# Altium project Servo Bus Controller.PrjPcb
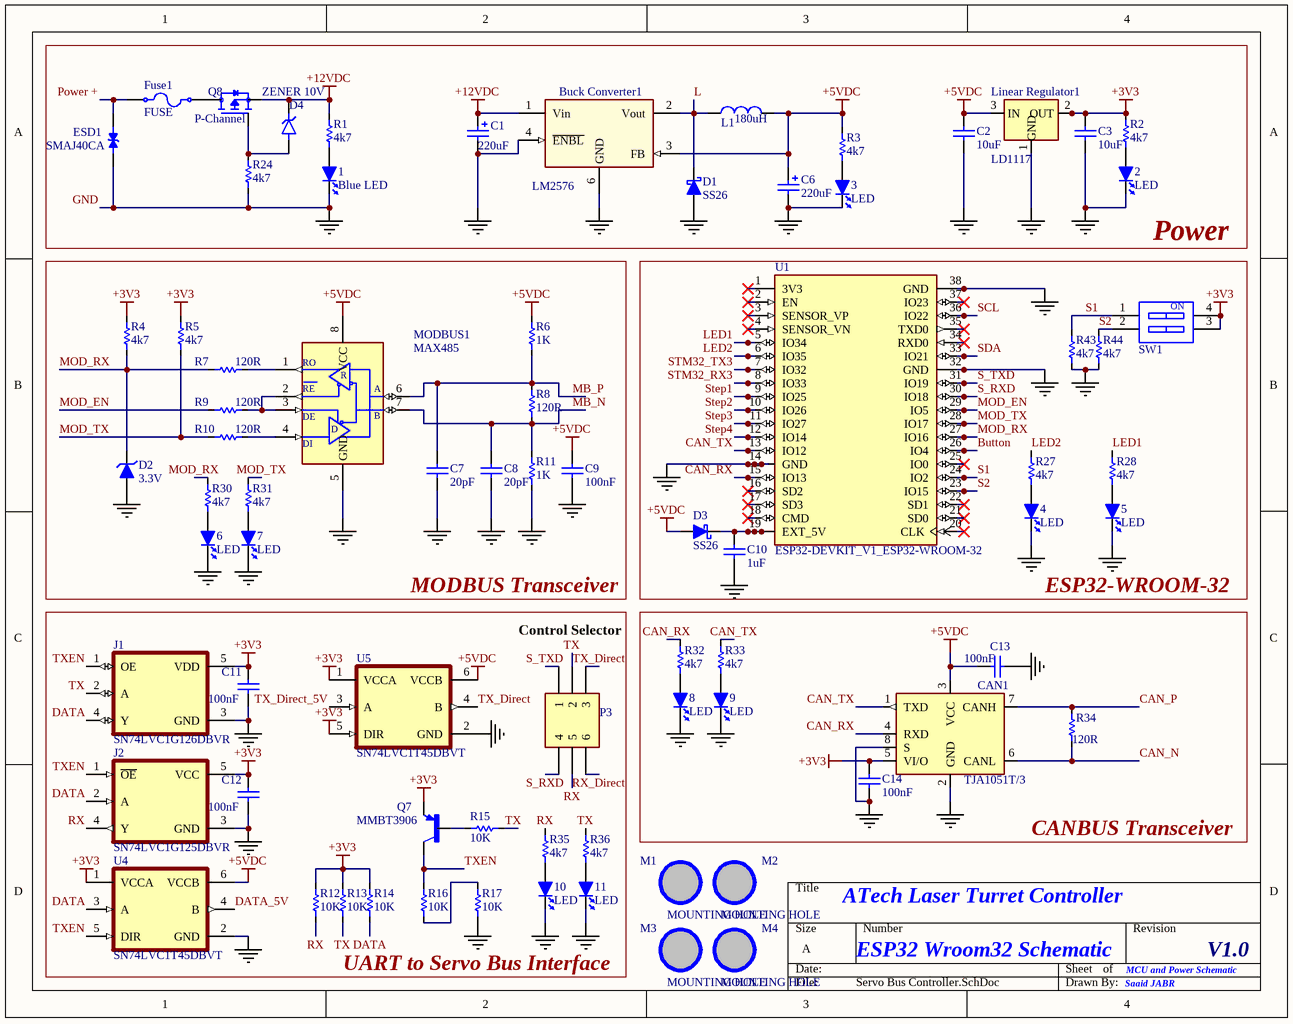
[diagram p0: Servo Bus Controller.SchDoc]
3 sheets, 209 parts. Net scope: global (net labels, ports and power ports of the same name join across sheets).
Board file: LaserTurretController.PcbDoc
Sheets:
  Servo Bus Controller.SchDoc
  STM32 Control.SchDoc
  Actuator Control.SchDoc

## Sheet Servo Bus Controller.SchDoc
size A; SheetNumber: 1; SheetTotal: 3

### Parts
1  Blue LED  [LED1206]
2  LED  [LED1206]
3  LED  [LED1206]
4  LED  [LED1206]
5  LED  [LED1206]
6  LED  [LED1206]
7  LED  [LED1206]
8  LED  [LED1206]
9  LED  [LED1206]
10  LED  [LED1206]
11  LED  [LED1206]
Buck_Converter1  LM2576  [TO-263BA]
C1  220uF  [CAP AL-EL H12MM D8MM P3.5MM]
C2  10uF  [CC3216-1206L]
C3  10uF  [CC3216-1206L]
C6  220uF  [CAP AL-EL H12MM D8MM P3.5MM]
C7  20pF  [CC3216-1206L]
C8  20pF  [CC3216-1206L]
C9  100nF  [CC3216-1206L]
C10  1uF  [CC3216-1206L]
C11  100nF  [CC3216-1206L]
C12  100nF  [CC3216-1206L]
C13  100nF  [CC3216-1206L]
C14  100nF  [CC3216-1206L]
CAN1  TJA1051T/3  [SOT96-1]
D1  SS26  [SMB]
D2  3.3V  [SOD123]
D3  SS26  [SMB]
D4  ZENER 10V  [DIOAD1036W73L450D282]
ESD1  SMAJ40CA  [DIOM4325X250N]
Fuse1  FUSE  [FUSE 5x20]
J1  SN74LVC1G126DBVR  [SOT95P280X145-5N]
J2  SN74LVC1G125DBVR  [SOT95P280X145-5N]
L1  180uH  [FPI1005]
Linear_Regulator1  LD1117  [SOT230P700X180-4N]
M1  MOUNTING HOLE  [MOUNTING HOLE ROUND NONPLATED 3MM PLASTIC]  (no BOM)
M2  MOUNTING HOLE  [MOUNTING HOLE ROUND NONPLATED 3MM PLASTIC]  (no BOM)
M3  MOUNTING HOLE  [MOUNTING HOLE ROUND NONPLATED 3MM PLASTIC]  (no BOM)
M4  MOUNTING HOLE  [MOUNTING HOLE ROUND NONPLATED 3MM PLASTIC]  (no BOM)
MODBUS1  MAX485  [SOIC127P600X175-8N]
P3  CONNECTOR, 1x3, 3P  [HDR_MALE_2X3_6P_2.54MM_180]  (value not drawn)
Q7  MMBT3906  [SOT95P260X140-3N]
Q8  P-Channel  [TO254P1052X465X1989-3]
R1  4k7  [CR3216-1206l]
R2  4k7  [CR3216-1206l]
R3  4k7  [CR3216-1206l]
R4  4k7  [CR3216-1206l]
R5  4k7  [CR3216-1206l]
R6  1K  [CR3216-1206l]
R7  120R  [CR3216-1206l]
R8  120R  [CR3216-1206l]
R9  120R  [CR3216-1206l]
R10  120R  [CR3216-1206l]
R11  1K  [CR3216-1206l]
R12  10K  [CR3216-1206l]
R13  10K  [CR3216-1206l]
R14  10K  [CR3216-1206l]
R15  10K  [CR3216-1206l]
R16  10K  [CR3216-1206l]
R17  10K  [CR3216-1206l]
R24  4k7  [CR3216-1206l]
R27  4k7  [CR3216-1206l]
R28  4k7  [CR3216-1206l]
R30  4k7  [CR3216-1206l]
R31  4k7  [CR3216-1206l]
R32  4k7  [CR3216-1206l]
R33  4k7  [CR3216-1206l]
R34  120R  [CR3216-1206l]
R35  4k7  [CR3216-1206l]
R36  4k7  [CR3216-1206l]
R43  4k7  [CR3216-1206l]
R44  4k7  [CR3216-1206l]
SW1  DIP Switch  [418117170902]  (value not drawn)
U1  ESP32-DEVKIT_V1_ESP32-WROOM-32  [MODULE_DEVKIT_V1_ESP32-WROOM-32]
U4  SN74LVC1T45DBVT  [SOT95P280X145-6N]
U5  SN74LVC1T45DBVT  [SOT95P280X145-6N]

### Blocks framed on the sheet
MODBUS Transceiver: 6 7 C7-C9 D2 MODBUS1 R4-R11 R30 R31
Power: 4 5 C10 D3 R27 R28 R43 R44 SW1 U1
UART to Servo Bus Interface: 10 11 C11 C12 J1 J2 P3 Q7 R12-R17 R35 R36 U4 U5

### Nets
3V3: U1.39(3V3)
+3V3: C3.1 C11.1 C12.1 C14.1 CAN1.5(VI/O) J1.5(VDD) J2.5(VCC) Linear_Regulator1.2(OUT) Linear_Regulator1.4(OUT) Q7.2(E) R2.2 R4.2 R5.2 R12.2 R13.2 R14.2 SW1.3 SW1.4 U4.1(VCCA) U5.1(VCCA) U5.5(DIR)
+5VDC: Buck_Converter1.3(FB) C2.1 C6.1 C9.1 C13.2 CAN1.3(VCC) D3.1 L1.2 Linear_Regulator1.3(IN) MODBUS1.8(VCC) R3.2 R6.1 U4.6(VCCB) U5.6(VCCB)
+12VDC: Buck_Converter1.1(Vin) C1.1 D4.C(K) Q8.3(S) R1.2
CLK: U1.76(CLK)
CMD: U1.56(CMD)
EN: U1.40(EN)
EXT_5V: U1.57(EXT_5V)
GND: 1.2(CATHODE) 2.2(CATHODE) 3.2(CATHODE) 4.2(CATHODE) 5.2(CATHODE) 6.2(CATHODE) 7.2(CATHODE) 8.2(CATHODE) 9.2(CATHODE) 10.2(CATHODE) 11.2(CATHODE) Buck_Converter1.4(~{ENBL}) Buck_Converter1.6(GND) C1.2 C2.2 C3.2 C6.2 C7.2 C8.2 C9.2 C10.2 C11.2 C12.2 C13.1 C14.2 CAN1.2(GND) CAN1.8(S) D1.1 D2.1 ESD1.1 J1.3(GND) J2.3(GND) Linear_Regulator1.1(GND) MODBUS1.5(GND) R11.2 R17.2 R24.2 R43.1 R44.1 U1.14(GND) U1.32(GND) U1.38(GND) U1.52(GND) U1.58(GND) U1.64(GND) U1.102(GND) U1.103(GND) U4.2(GND) U5.2(GND)
IO0: U1.71(IO0)
IO2: U1.72(IO2)
IO4: U1.70(IO4)
IO5: U1.67(IO5)
IO12: U1.51(IO12)
IO13: U1.53(IO13)
IO14: U1.50(IO14)
IO15: U1.73(IO15)
IO16: U1.69(IO16)
IO17: U1.68(IO17)
IO18: U1.66(IO18)
IO19: U1.65(IO19)
IO21: U1.63(IO21)
IO22: U1.60(IO22)
IO23: U1.59(IO23)
IO25: U1.47(IO25)
IO26: U1.48(IO26)
IO27: U1.49(IO27)
IO32: U1.45(IO32)
IO33: U1.46(IO33)
IO34: U1.43(IO34)
IO35: U1.44(IO35)
RXD0: U1.62(RXD0)
SD0: U1.75(SD0)
SD1: U1.74(SD1)
SD2: U1.54(SD2)
SD3: U1.55(SD3)
SENSOR_VN: U1.42(SENSOR_VN)
SENSOR_VP: U1.41(SENSOR_VP)
TXD0: U1.61(TXD0)
Button: U1.26(IO4) U1.70(IO4)
CAN_N: CAN1.6(CANL) R34.1
CAN_P: CAN1.7(CANH) R34.2
CAN_RX: CAN1.4(RXD) R32.2 U1.15(IO13) U1.53(IO13)
CAN_TX: CAN1.1(TXD) R33.2 U1.13(IO12) U1.51(IO12)
DATA: J1.4(Y) J2.2(A) R14.1 U4.3(A)
DATA_5V: U4.4(B)
L: Buck_Converter1.2(Vout) D1.2 L1.1
LED1: R28.2 U1.5(IO34) U1.43(IO34)
LED2: R27.2 U1.6(IO35) U1.44(IO35)
MB_N: C8.1 MODBUS1.7(B) R8.2 R11.1
MB_P: C7.1 MODBUS1.6(A) R6.2 R8.1
MOD_EN: R9.2 U1.29(IO5) U1.67(IO5)
MOD_RX: D2.2 R4.1 R7.2 R30.2 U1.27(IO16) U1.69(IO16)
MOD_TX: R5.1 R10.2 R31.2 U1.28(IO17) U1.68(IO17)
Power +: ESD1.2 Fuse1.1
RX: J2.4(Y) P3.5 R12.1 R35.2
RX_Direct: P3.6
S1: R43.2 SW1.1 U1.24(IO2) U1.72(IO2)
S2: R44.2 SW1.2 U1.23(IO15) U1.73(IO15)
S_RXD: P3.4 U1.30(IO18) U1.66(IO18)
S_TXD: P3.1 U1.31(IO19) U1.65(IO19)
SCL: U1.36(IO22) U1.60(IO22)
SDA: U1.33(IO21) U1.63(IO21)
Step1: U1.9(IO25) U1.47(IO25)
Step2: U1.10(IO26) U1.48(IO26)
Step3: U1.11(IO27) U1.49(IO27)
Step4: U1.12(IO14) U1.50(IO14)
STM32_RX3: U1.8(IO33) U1.46(IO33)
STM32_TX3: U1.7(IO32) U1.45(IO32)
TX: J1.2(A) P3.2 R13.1 R15.1 R36.2
TX_Direct: P3.3 U5.4(B)
TX_Direct_5V: U5.3(A)
TXEN: J1.1(OE) J2.1(~{OE}) Q7.3(C) R16.1 U4.5(DIR)
Net1_1: 1.1(ANODE) R1.1
Net2_1: 2.1(ANODE) R2.1
Net3_1: 3.1(ANODE) R3.1
Net4_1: 4.1(ANODE) R27.1
Net5_1: 5.1(ANODE) R28.1
Net6_1: 6.1(ANODE) R30.1
Net7_1: 7.1(ANODE) R31.1
Net8_1: 8.1(ANODE) R32.1
Net9_1: 9.1(ANODE) R33.1
Net10_1: 10.1(ANODE) R35.1
Net11_1: 11.1(ANODE) R36.1
NetC10_1: C10.1 D3.2 U1.19(EXT_5V) U1.57(EXT_5V) U1.101(EXT_5V) U1.104(EXT_5V)
NetD4_A: D4.A Q8.1(G) R24.1
NetFuse1_2: Fuse1.2 Q8.2(D)
NetMODBUS1_1: MODBUS1.1(RO) R7.1
NetMODBUS1_2: MODBUS1.2(~{RE}) MODBUS1.3(DE) R9.1
NetMODBUS1_4: MODBUS1.4(DI) R10.1
NetQ7_1: Q7.1(B) R15.2
NetR16_2: R16.2 R17.1
NetU1_1: U1.1(3V3) U1.39(3V3)
NetU1_2: U1.2(EN) U1.40(EN)
NetU1_3: U1.3(SENSOR_VP) U1.41(SENSOR_VP)
NetU1_4: U1.4(SENSOR_VN) U1.42(SENSOR_VN)
NetU1_16: U1.16(SD2) U1.54(SD2)
NetU1_17: U1.17(SD3) U1.55(SD3)
NetU1_18: U1.18(CMD) U1.56(CMD)
NetU1_20: U1.20(CLK) U1.76(CLK)
NetU1_21: U1.21(SD0) U1.75(SD0)
NetU1_22: U1.22(SD1) U1.74(SD1)
NetU1_25: U1.25(IO0) U1.71(IO0)
NetU1_34: U1.34(RXD0) U1.62(RXD0)
NetU1_35: U1.35(TXD0) U1.61(TXD0)
NetU1_37: U1.37(IO23) U1.59(IO23)

Not connected (* = marked no-connect by the designer): Buck_Converter1 5(NC) 7(NC) 8(NC)

### Notes on the sheet
- Control Selector
- ESP32-WROOM-32
- CANBUS Transceiver
- ATech Laser Turret Controller
- ESP32 Wroom32 Schematic
- MCU and Power Schematic
- V1.0
- Saaid JABR
- (in symbol DIP Switch 2) ON
- (in symbol MAX485) R; RE; D

### Library data of the parts
1 = LED: Ozdisan: HL-PSC-2012H203BC; Stock Code: *; Component Type: Diode; PriceUSD: 0.0007685
2-11 = LED: Ozdisan: HL-PC-3216U51GC; Stock Code: *; Component Type: Diode; PriceUSD: 0.0016
Buck_Converter1 = LM2576DP: 3A, 52kHz, Step-Down Switching Regulator; Ozdisan: *; PriceUSD: *
C1 C6 = CAPACITOR POL: Capacitor; Ozdisan: PKRM-025V221MF115-T/A5.0; Stock Code: *; Component Type: Capacitor; PriceUSD: 0.02312
C2 C3 C10 = CAPACITOR NON-POL: Capacitor; Ozdisan: CL31B106KAHNNNE; Stock Code: *; Component Type: Capacitor; PriceUSD: 0.006808
C7 C8 = CAPACITOR NON-POL: Capacitor; Ozdisan: CL31C220JBCNNNC; Stock Code: *; Component Type: Capacitor; PriceUSD: 0.006466
C9 C13 C14 = CAPACITOR NON-POL: Capacitor; Ozdisan: CL31B104KCFNNNE; Stock Code: *; Component Type: Capacitor; PriceUSD: 0.001135
C11 C12 = CAPACITOR NON-POL: Capacitor; Stock Code: *; Component Type: Capacitor
CAN1 = TJA1051T/3: 1/1 ÐŸÑ€Ð¸ÐµÐ¼Ð¾Ð¿ÐµÑ€ÐµÐ´Ð°Ñ‚Ñ‡Ð¸Ðº ÐŸÐ¾Ð»Ð¾Ð²Ð¸Ð½Ð° CANbus 8-SO; MF: NXP USA; Ozdisan: TJA1051T/3,118; Price: None; Availability: In Stock; Purchase-URL: https://pricing.snapeda.com/search/part/TJA1051T/3/?ref=eda; SnapEDA_Link: https://www.snapeda.com/parts/TJA1051T/3/NXP+USA+Inc./view-part/?ref=snap; MP: TJA1051T/3; Value: *; Check_prices: https://www.snapeda.com/parts/TJA1051T/3/NXP+USA+Inc./view-part/?ref=eda; Package: SO-8 NXP Semiconductors; PriceUSD: 0.61954
D1 D3 = DIODE SCHOTTKY: SINGLE SCHOTTKY DIODE / Check the suitability of the case with the pin number; Ozdisan: SS26-SMB-JQ; Stock Code: *; Component Type: Diode; PriceUSD: 0.006698
D2 = DIODE ZENER: Ozdisan: MMSZ3V3-HT; Component Type: Diode; Stock Code: *; PriceUSD: 0.001732
D4 = DIODE ZENER: DIODE BZX85C10 Zener Diode 10 V 1.3 W Â±5% Through Hole DO-204AL (DO-41); MF: Taiwan Semiconductor; SnapEDA_Link: https://www.snapeda.com/parts/BZX85C10/Taiwan+Semiconductor/view-part/?ref=snap; Package: DO-41-2 Taiwan Semiconductor; Value: *; MP: BZX85C10; Check_prices: https://www.snapeda.com/parts/BZX85C10/Taiwan+Semiconductor/view-part/?ref=eda
ESD1 = SMAJ40CA: MP: SMAJ40CA-HT; Price: None; Availability: Unavailable; Package: None; Value: *; Ozdisan: SMAJ40CA-HT; PriceUSD: 0.012908
Fuse1 = FUSE: Ozdisan: L-KLS5-2611; Component Type: Fuse; Stock Code: *; PriceUSD: 0.12995
J1 = SN74LVC1G126DBVR: Single 1.65-V to 5.5-V buffer with 3-state outputs; MF: Texas Instruments; SnapEDA_Link: https://www.snapeda.com/parts/SN74LVC1G126DBVR/Texas+Instruments/view-part/?ref=snap; Package: SOT-23-5 Texas Instruments; Value: *; MP: SN74LVC1G126DBVR; Check_prices: https://www.snapeda.com/parts/SN74LVC1G126DBVR/Texas+Instruments/view-part/?ref=eda
J2 = SN74LVC1G125DBVR: Single 1.65-V to 5.5-V buffer with 3-state outputs; MF: Texas Instruments; SnapEDA_Link: https://www.snapeda.com/parts/SN74LVC1G125DBVR/Texas+Instruments/view-part/?ref=snap; Package: SOT-23-5 Texas Instruments; Value: *; MP: SN74LVC1G125DBVR; Check_prices: https://www.snapeda.com/parts/SN74LVC1G125DBVR/Texas+Instruments/view-part/?ref=eda
L1 = INDUCTOR: Ozdisan: FP11005-181M; Stock Code: *; Component Type: Inductor; PriceUSD: 0.21045
Linear_Regulator1 = LM1117: Linear Voltage Regulators; Ozdisan: LD1117AS33TR; Component Type: IC; Stock Code: *; PriceUSD: 0.08667
MODBUS1 = MAX485: ROHS-ICMAX485CSA MAXIM; Ozdisan: SN65HVD485EDR; Stock Code: *; Component Type: IC; PriceUSD: 0.81157
P3 = CONNECTOR, 2x3, 3P: Component Type: Connector
Q7 = MMBT3906: Trans GP BJT PNP 40V 3-Pin SOT-23; MF: Rectron; SnapEDA_Link: https://www.snapeda.com/parts/MMBT3906/Rectron/view-part/?ref=snap; Package: None; Value: *; MP: MMBT3906; Check_prices: https://www.snapeda.com/parts/MMBT3906/Rectron/view-part/?ref=eda
Q8 = IRF9540: P-Channel 100 V 19A (Tc) 3.7W (Ta), 150W (Tc) Surface Mount DÂ²PAK (TO-263); MF: Vishay; SnapEDA_Link: https://www.snapeda.com/parts/IRF9540/Vishay+Siliconix/view-part/?ref=snap; Package: TO-220-3 Vishay; Value: *; MP: IRF9540; Check_prices: https://www.snapeda.com/parts/IRF9540/Vishay+Siliconix/view-part/?ref=eda
R1-R5 R24 R27 R28 R30-R33 R35 R36 R43 R44 = RESISTOR: Ozdisan: RC1206JR-074K7L; Component Type: Resistor; PriceUSD: 0.0000351
R6 R11 = RESISTOR: Ozdisan: 1206S4F1001T5E; Component Type: Resistor; PriceUSD: 0.0000312
R7-R10 R34 = RESISTOR: Ozdisan: RC1206JR-07120RL; Component Type: Resistor; PriceUSD: 0.0000351
R12-R17 = RESISTOR: Component Type: Resistor
SW1 = DIP Switch 2: WS-DITV Compact THT Dip Switch, Flat Actuator, pitch 2.54mm, 2p; Manufacturer: Wurth Elektronik; Actuator Type: Flat Type; Operation Force: 800g; Rated Current Non-Switching: 100mA; Rated Current Switching: 25mA; Rated Voltage Non-Switching: 50VDC; Rated Voltage Switching: 24VDC; Number of Poles: 2; ComponentLink1Description: Website Link; ComponentLink1URL: https://www.we-online.com/redexpert/article/418117170902?ad; ComponentLink2Description: Datasheet Link; ComponentLink2URL: https://www.we-online.com/redexpert/spec/418117170902?ad; Manufacturer Part Number: 418117170902; Category: Dip Switches; Match Code: WS-DITV; Mount: Through Hole; Operating Temperature Max: 85°C; Operating Temperature Min: -40°C; Packaging: Tube; Contact Material: Copper Alloy; Contact Plating: Gold; Pitch: 2.54mm
U1 = ESP32-DEVKIT_V1_ESP32-WROOM-32: WROOM-32 Development Board ESP32 ESP-32S WiFi Bluetooth Dev Module; MF: Espressif Systems; MP: DEVKIT V1 ESP32-WROOM-32; SnapEDA_Link: https://www.snapeda.com/parts/DEVKIT%20V1%20ESP32-WROOM-32/Espressif+Systems/view-part/?ref=snap; Package: Package; Value: *; Check_prices: https://www.snapeda.com/parts/DEVKIT%20V1%20ESP32-WROOM-32/Espressif+Systems/view-part/?ref=eda
U4 U5 = Level Shiftter: Single-Bit Dual-Supply Bus Transceiver with Configurable Voltage-Level Shifting and 3-State Outputs; MF: Texas Instruments; SnapEDA_Link: https://www.snapeda.com/parts/SN74LVC1T45DBVT/Texas+Instruments/view-part/?ref=snap; Package: SOT-23-6 Texas Instruments; Value: *; MP: SN74LVC1T45DBVT; Check_prices: https://www.snapeda.com/parts/SN74LVC1T45DBVT/Texas+Instruments/view-part/?ref=eda
M1-M4 = MOUNTING HOLE: Ozdisan: *; PriceUSD: *

## Sheet STM32 Control.SchDoc
size A; SheetNumber: 2; SheetTotal: 3
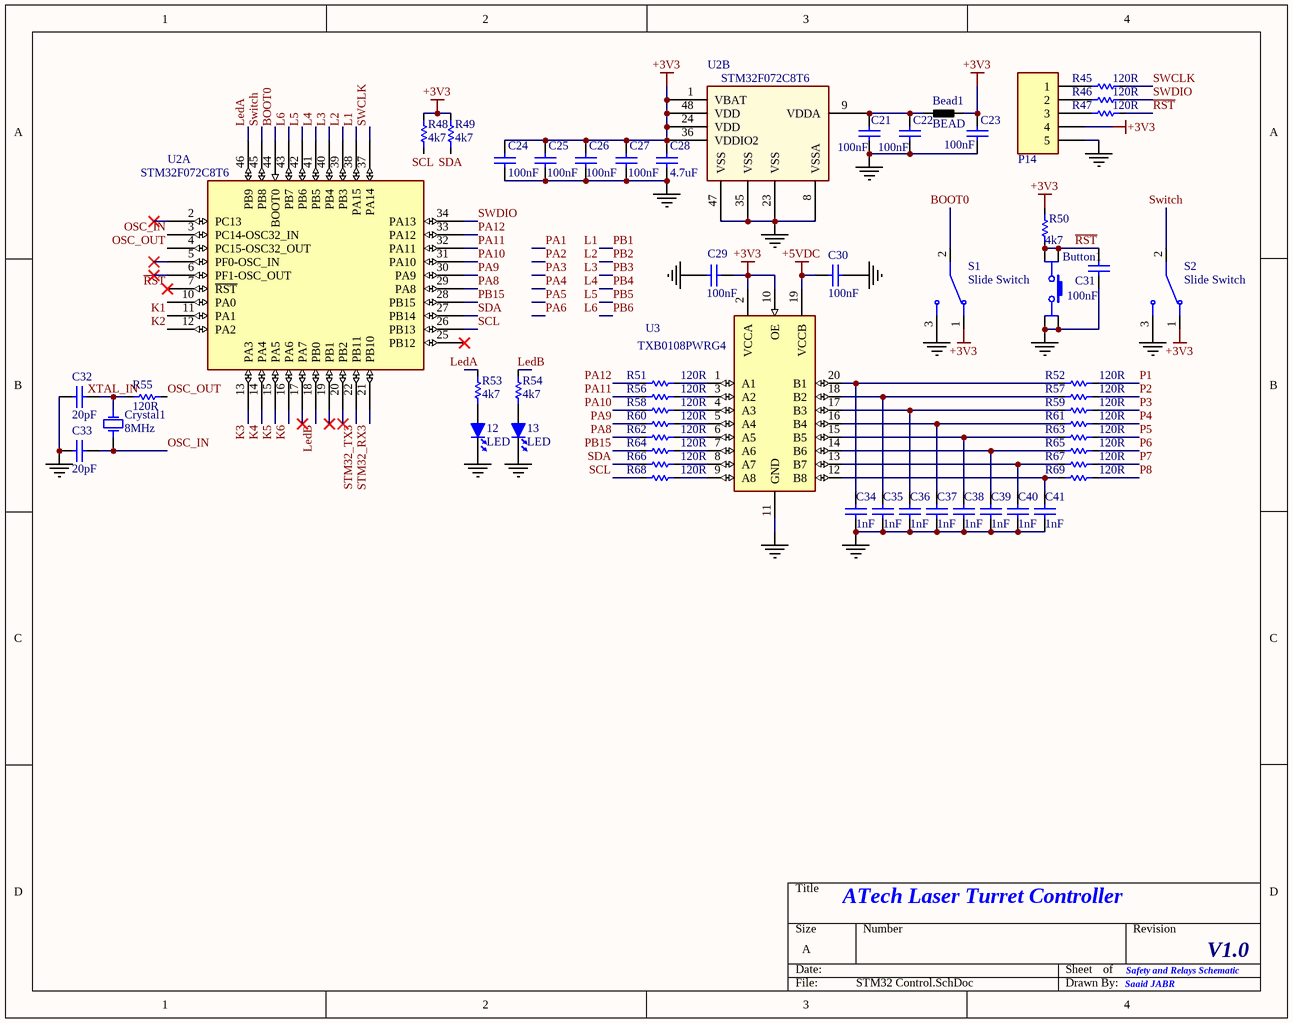
[diagram p1: STM32 Control.SchDoc]

### Parts
12  LED  [LED1206]
13  LED  [LED1206]
Bead1  BEAD  [CL3216-1206L]
Button1  SWITCH TACT  [SWITCH TACTILE SMD 6x6 4.3mm]  (value not drawn)
C21  100nF  [CC3216-1206L]
C22  100nF  [CC3216-1206L]
C23  100nF  [CC3216-1206L]
C24  100nF  [CC3216-1206L]
C25  100nF  [CC3216-1206L]
C26  100nF  [CC3216-1206L]
C27  100nF  [CC3216-1206L]
C28  4.7uF  [CC3216-1206L]
C29  100nF  [CC3216-1206L]
C30  100nF  [CC3216-1206L]
C31  100nF  [CC3216-1206L]
C32  20pF  [CC3216-1206L]
C33  20pF  [CC3216-1206L]
C34  1nF  [CC3216-1206L]
C35  1nF  [CC3216-1206L]
C36  1nF  [CC3216-1206L]
C37  1nF  [CC3216-1206L]
C38  1nF  [CC3216-1206L]
C39  1nF  [CC3216-1206L]
C40  1nF  [CC3216-1206L]
C41  1nF  [CC3216-1206L]
Crystal1  8MHz  [HC49S SMD]
P14  CONNECTOR, 1x5, 5P  [HDR_MALE_1X5_5P_2.54MM_180]  (value not drawn)
R45  120R  [CR3216-1206l]
R46  120R  [CR3216-1206l]
R47  120R  [CR3216-1206l]
R48  4k7  [CR3216-1206l]
R49  4k7  [CR3216-1206l]
R50  4k7  [CR3216-1206l]
R51  120R  [CR3216-1206l]
R52  120R  [CR3216-1206l]
R53  4k7  [CR3216-1206l]
R54  4k7  [CR3216-1206l]
R55  120R  [CR3216-1206l]
R56  120R  [CR3216-1206l]
R57  120R  [CR3216-1206l]
R58  120R  [CR3216-1206l]
R59  120R  [CR3216-1206l]
R60  120R  [CR3216-1206l]
R61  120R  [CR3216-1206l]
R62  120R  [CR3216-1206l]
R63  120R  [CR3216-1206l]
R64  120R  [CR3216-1206l]
R65  120R  [CR3216-1206l]
R66  120R  [CR3216-1206l]
R67  120R  [CR3216-1206l]
R68  120R  [CR3216-1206l]
R69  120R  [CR3216-1206l]
S1  Slide Switch  [SSL-12F20-G4-P]
S2  Slide Switch  [SSL-12F20-G4-P]
U2  STM32F072C8T6  [QFP50P900X900X160-48N]  (parts A,B of 2)
U3  TXB0108PWRG4  [SOP65P640X120-20N]

### Nets
+3V3: Bead1.1 C23.1 C24.1 C25.1 C26.1 C27.1 C28.1 C29.1 P14.4 R48.2 R49.2 R50.2 S1.1(NC) S2.1(NC) U2.1(VBAT) U2.24(VDD) U2.36(VDDIO2) U2.48(VDD) U3.2(VCCA) U3.10(OE)
+5VDC: C30.1 U3.19(VCCB)
GND: 12.2(CATHODE) 13.2(CATHODE) Button1.3(B) Button1.4(B) C21.2 C22.2 C23.2 C24.2 C25.2 C26.2 C27.2 C28.2 C29.2 C30.2 C31.2 C32.1 C33.1 C34.2 C35.2 C36.2 C37.2 C38.2 C39.2 C40.2 C41.2 P14.5 S1.3(NO) S2.3(NO) U2.8(VSSA) U2.23(VSS) U2.35(VSS) U2.47(VSS) U3.11(GND)
BOOT0: S1.2(COM) U2.44(BOOT0)
K1: U2.11(PA1)
K2: U2.12(PA2)
K3: U2.13(PA3)
K4: U2.14(PA4)
K5: U2.15(PA5)
K6: U2.16(PA6)
L1: U2.38(PA15)  [also labelled PB1]
L2: U2.39(PB3)  [also labelled PB2]
L3: U2.40(PB4)  [also labelled PB3]
L4: U2.41(PB5)  [also labelled PB4]
L5: U2.42(PB6)  [also labelled PB5]
L6: U2.43(PB7)  [also labelled PB6]
LedA: R53.2 U2.46(PB9)
LedB: R54.2 U2.18(PB0)
OSC_IN: C33.2 Crystal1.1(OSC1) U2.3(PC14-OSC32_IN)
OSC_OUT: R55.1 U2.4(PC15-OSC32_OUT)
P1: R52.2
P2: R57.2
P3: R59.2
P4: R61.2
P5: R63.2
P6: R65.2
P7: R67.2
P8: R69.2
PA8: R62.1 U2.29(PA8)
PA9: R60.1 U2.30(PA9)
PA10: R58.1 U2.31(PA10)
PA11: R56.1 U2.32(PA11)
PA12: R51.1 U2.33(PA12)
PB15: R64.1 U2.28(PB15)
~{RST}: Button1.1(A) Button1.2(A) C31.1 R46.2 R50.1 U2.7(~{RST})
SCL: R48.1 R68.1 U2.26(PB13)
SDA: R49.1 R66.1 U2.27(PB14)
STM32_RX3: U2.21(PB10)
STM32_TX3: U2.22(PB11)
SWCLK: R45.2 U2.37(PA14)
SWDIO: R47.2 U2.34(PA13)
Switch: S2.2(COM) U2.45(PB8)
XTAL_IN: C32.2 Crystal1.2(OSC2) R55.2
Net12_1: 12.1(ANODE) R53.1
Net13_1: 13.1(ANODE) R54.1
NetBead1_2: Bead1.2 C21.1 C22.1 U2.9(VDDA)
NetC34_1: C34.1 R52.1 U3.20(B1)
NetC35_1: C35.1 R57.1 U3.18(B2)
NetC36_1: C36.1 R59.1 U3.17(B3)
NetC37_1: C37.1 R61.1 U3.16(B4)
NetC38_1: C38.1 R63.1 U3.15(B5)
NetC39_1: C39.1 R65.1 U3.14(B6)
NetC40_1: C40.1 R67.1 U3.13(B7)
NetC41_1: C41.1 R69.1 U3.12(B8)
NetP14_1: P14.1 R45.1
NetP14_2: P14.2 R47.1
NetP14_3: P14.3 R46.1
NetR51_2: R51.2 U3.1(A1)
NetR56_2: R56.2 U3.3(A2)
NetR58_2: R58.2 U3.4(A3)
NetR60_2: R60.2 U3.5(A4)
NetR62_2: R62.2 U3.6(A5)
NetR64_2: R64.2 U3.7(A6)
NetR66_2: R66.2 U3.8(A7)
NetR68_2: R68.2 U3.9(A8)

Not connected (* = marked no-connect by the designer): U2 2(PC13)* 5(PF0-OSC_IN)* 6(PF1-OSC_OUT)* 10(PA0) 17(PA7)* 19(PB1)* 20(PB2)* 25(PB12)*

### Notes on the sheet
- ATech Laser Turret Controller
- Safety and Relays Schematic
- V1.0
- Saaid JABR

### Library data of the parts
12 13 = LED: Ozdisan: HL-PC-3216U51GC; Stock Code: *; Component Type: Diode; PriceUSD: 0.0016
Bead1 = BEAD: FERRITE BEAD; Ozdisan: LCB3216-100Y-N; Stock Code: *; Component Type: Inductor; PriceUSD: 0.002305
Button1 = SWITCH TACT: TACT SWITCH; Ozdisan: DTSM-61S-V-T/R; Stock Code: *; Component Type: Switch; PriceUSD: 0.22264
C21-C27 C29-C31 = CAPACITOR NON-POL: Capacitor; Ozdisan: CL31B104KCFNNNE; Stock Code: *; Component Type: Capacitor; PriceUSD: 0.001135
C28 = CAPACITOR NON-POL: Capacitor; Ozdisan: CL31B475KBHNNNE; Stock Code: *; Component Type: Capacitor; PriceUSD: 0.016518
C32 C33 = CAPACITOR NON-POL: Capacitor; Ozdisan: CL31C220JBCNNNC; Stock Code: *; Component Type: Capacitor; PriceUSD: 0.006466
C34-C41 = CAPACITOR NON-POL: Capacitor; Ozdisan: CL31B102KBCNNNC; Stock Code: *; Component Type: Capacitor; PriceUSD: 0.00127
Crystal1 = XTAL: Ozdisan: AS-8.OOO-20-SMD-TR; Stock Code: *; Component Type: XTAL; PriceUSD: 0.070265
R45-R47 R51 R52 R55-R69 = RESISTOR: Ozdisan: RC1206JR-07120RL; Component Type: Resistor; PriceUSD: 0.0000351
R48-R50 R53 R54 = RESISTOR: Ozdisan: RC1206JR-074K7L; Component Type: Resistor; PriceUSD: 0.0000351
S1 S2 = Slide Switch: Slide Switch SPDT Through Hole; MP: 500SSP1S2M2QEA; Package: None; Value: *; Price: None; Availability: Unavailable
U2 = STM32F072C8T6: ARMÂ® CortexÂ®-M0 STM32F0 Microcontroller IC 32-Bit Single-Core 48MHz 64KB (64K x 8) FLASH 48-LQFP (7x7); MF: STMicroelectronics; SnapEDA_Link: https://www.snapeda.com/parts/STM32F072C8T6/STMicroelectronics/view-part/?ref=snap; Package: LQFP-48 STMicroelectronics; Value: *; MP: STM32F072C8T6; Check_prices: https://www.snapeda.com/parts/STM32F072C8T6/STMicroelectronics/view-part/?ref=eda
U3 = TXB0108PWRG4: 8-Bit Bidirectional Voltage-Level Shifter with Auto Direction Sensing and +/-15-kV ESD Protect 20-TSSOP -40 to 85; MF: Texas Instruments; Value: *; Check_prices: https://www.snapeda.com/parts/TXB0108PWRG4/Texas+Instruments/view-part/?ref=eda; SnapEDA_Link: https://www.snapeda.com/parts/TXB0108PWRG4/Texas+Instruments/view-part/?ref=snap; Availability: In Stock; MP: TXB0108PWRG4; Purchase-URL: https://pricing.snapeda.com/search/part/TXB0108PWRG4/?ref=eda; Package: TSSOP-20 Texas Instruments; Price: None
P14 = CONNECTOR, 1x5, 5P: Component Type: Connector

## Sheet Actuator Control.SchDoc
size A; SheetNumber: 3; SheetTotal: 3
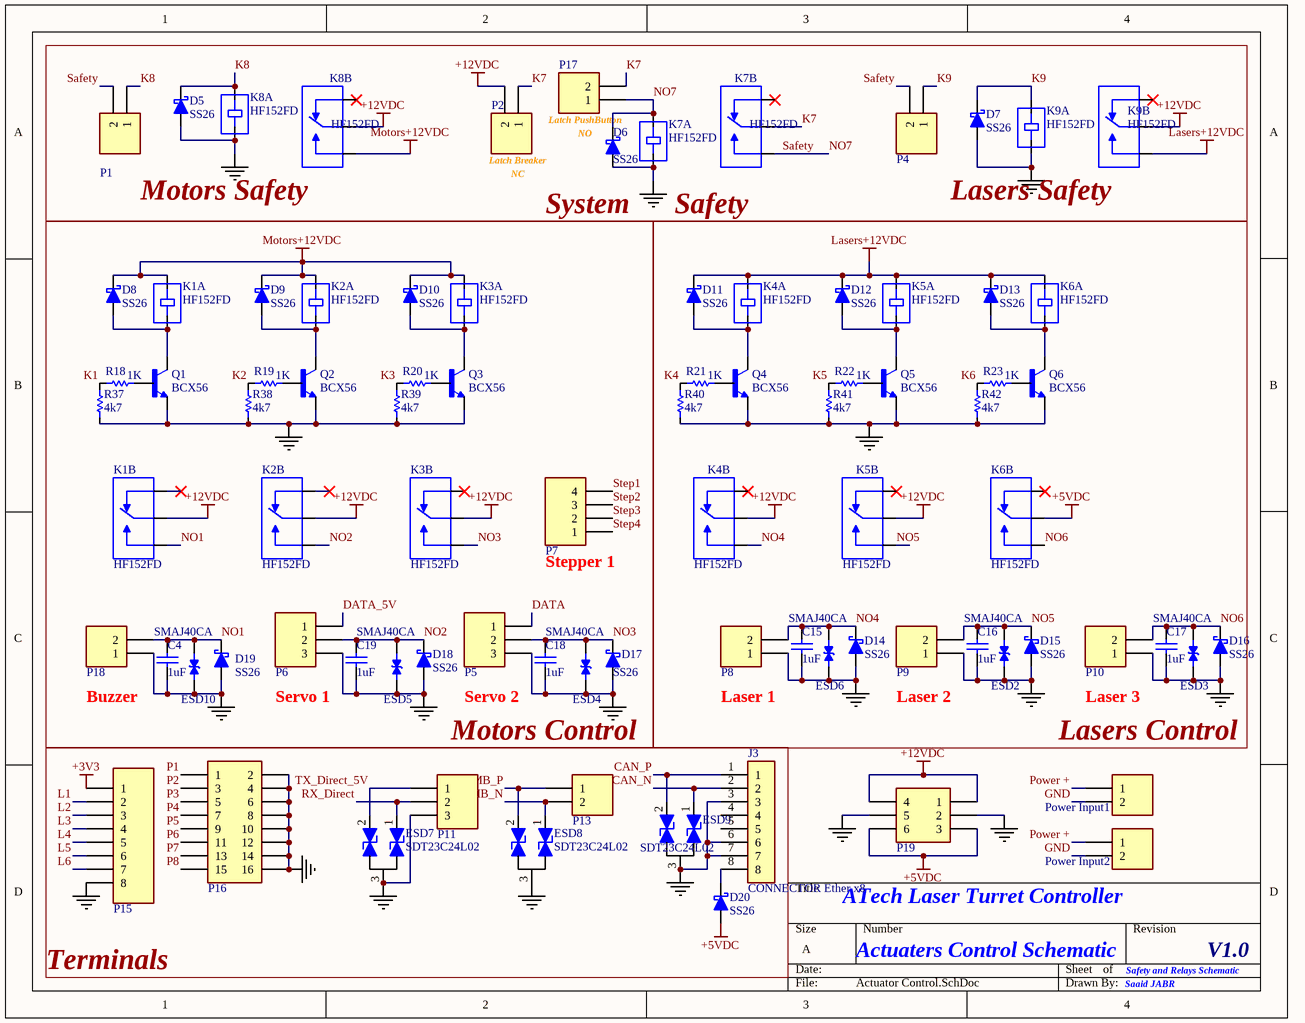
[diagram p2: Actuator Control.SchDoc]

### Parts
C4  1uF  [CC3216-1206L]
C15  1uF  [CC3216-1206L]
C16  1uF  [CC3216-1206L]
C17  1uF  [CC3216-1206L]
C18  1uF  [CC3216-1206L]
C19  1uF  [CC3216-1206L]
D5  SS26  [SMB]
D6  SS26  [SMB]
D7  SS26  [SMB]
D8  SS26  [SMB]
D9  SS26  [SMB]
D10  SS26  [SMB]
D11  SS26  [SMB]
D12  SS26  [SMB]
D13  SS26  [SMB]
D14  SS26  [SMB]
D15  SS26  [SMB]
D16  SS26  [SMB]
D17  SS26  [SMB]
D18  SS26  [SMB]
D19  SS26  [SMB]
D20  SS26  [SMB]
ESD2  SMAJ40CA  [DIOM4325X250N]
ESD3  SMAJ40CA  [DIOM4325X250N]
ESD4  SMAJ40CA  [DIOM4325X250N]
ESD5  SMAJ40CA  [DIOM4325X250N]
ESD6  SMAJ40CA  [DIOM4325X250N]
ESD7  SDT23C24L02  [SOT23-3]
ESD8  SDT23C24L02  [SOT23-3]
ESD9  SDT23C24L02  [SOT23-3]
ESD10  SMAJ40CA  [DIOM4325X250N]
J3  CONNECTOR Ether x8  [EtherNet 8P]
K1  HF152FD  [RELAY_HF152FD/012-1HS]  (parts A,B of 2)
K2  HF152FD  [RELAY_HF152FD/012-1HS]  (parts A,B of 2)
K3  HF152FD  [RELAY_HF152FD/012-1HS]  (parts A,B of 2)
K4  HF152FD  [RELAY_HF152FD/012-1HS]  (parts A,B of 2)
K5  HF152FD  [RELAY_HF152FD/012-1HS]  (parts A,B of 2)
K6  HF152FD  [RELAY_HF152FD/012-1HS]  (parts A,B of 2)
K7  HF152FD  [RELAY_HF152FD/012-1HS]  (parts A,B of 2)
K8  HF152FD  [RELAY_HF152FD/012-1HS]  (parts A,B of 2)
K9  HF152FD  [RELAY_HF152FD/012-1HS]  (parts A,B of 2)
P1  CONNECTOR, 1x2, 2P  [DG128-5.0-02P-14]  (value not drawn)
P2  CONNECTOR, 1x2, 2P  [DG128-5.0-02P-14]  (value not drawn)
P4  CONNECTOR, 1x2, 2P  [DG128-5.0-02P-14]  (value not drawn)
P5  CONNECTOR, 1x3, 3P  [HDR_MALE_1X3_2.50mm_JST]  (value not drawn)
P6  CONNECTOR, 1x3, 3P  [HDR_MALE_1X3_2.50mm_JST]  (value not drawn)
P7  CONNECTOR, 1x4, 4P  [HDR_MALE_1X4_2.50mm_JST]  (value not drawn)
P8  CONNECTOR, 1x2, 2P  [HDR_MALE_1X2_2.50mm_JST]  (value not drawn)
P9  CONNECTOR, 1x2, 2P  [HDR_MALE_1X2_2.50mm_JST]  (value not drawn)
P10  CONNECTOR, 1x2, 2P  [HDR_MALE_1X2_2.50mm_JST]  (value not drawn)
P11  CONNECTOR, 1x3, 3P  [HDR_MALE_1X3_3P_2.54MM_180]  (value not drawn)
P13  CONNECTOR, 1x2, 2P  [DG128-5.0-02P-14]  (value not drawn)
P15  CONNECTOR 1X8-8P  [HDR_MALE_1X8_8P_2.54MM_180]  (value not drawn)
P16  CONNECTOR 2X8-16P  [HDR_MALE_2X8_16P_2.54MM_180]  (value not drawn)
P17  CONNECTOR, 1x2, 2P  [DG128-5.0-02P-14]  (value not drawn)
P18  CONNECTOR, 1x2, 2P  [HDR_MALE_1X2_2.50mm_JST]  (value not drawn)
P19  CONNECTOR, 1x3, 3P  [HDR_MALE_2X3_6P_2.54MM_180]  (value not drawn)
Power_Input1  CONNECTOR, 1x2, 2P  [DG128-5.0-02P-14]  (value not drawn)
Power_Input2  CONNECTOR, 1x2, 2P  [2EDGVM-5.0-02P-14]  (value not drawn)
Q1  BCX56  [SOT89R_INFINEON]
Q2  BCX56  [SOT89R_INFINEON]
Q3  BCX56  [SOT89R_INFINEON]
Q4  BCX56  [SOT89R_INFINEON]
Q5  BCX56  [SOT89R_INFINEON]
Q6  BCX56  [SOT89R_INFINEON]
R18  1K  [CR3216-1206l]
R19  1K  [CR3216-1206l]
R20  1K  [CR3216-1206l]
R21  1K  [CR3216-1206l]
R22  1K  [CR3216-1206l]
R23  1K  [CR3216-1206l]
R37  4k7  [CR3216-1206l]
R38  4k7  [CR3216-1206l]
R39  4k7  [CR3216-1206l]
R40  4k7  [CR3216-1206l]
R41  4k7  [CR3216-1206l]
R42  4k7  [CR3216-1206l]

### Nets
+3V3: P15.1
+5VDC: D20.1 K6.3(COM) P19.3 P19.6
+12VDC: K1.3(COM) K2.3(COM) K3.3(COM) K4.3(COM) K5.3(COM) K8.3(COM) K9.3(COM) P2.2 P19.1 P19.4
GND: C4.2 C15.2 C16.2 C17.2 C18.2 C19.2 D5.1 D6.1 D7.1 D14.1 D15.1 D16.1 D17.1 D18.1 D19.1 ESD2.1 ESD3.1 ESD4.1 ESD5.1 ESD6.1 ESD7.3 ESD8.3 ESD9.3 ESD10.1 J3.3 J3.6 J3.7 K7.1(COIL2) K8.1(COIL2) K9.1(COIL2) P5.3 P6.3 P8.1 P9.1 P10.1 P11.3 P15.8 P16.2 P16.4 P16.6 P16.8 P16.10 P16.12 P16.14 P16.16 P18.1 P19.2 P19.5 Power_Input1.2 Power_Input2.2 Q1.3(E) Q2.3(E) Q3.3(E) Q4.3(E) Q5.3(E) Q6.3(E) R37.1 R38.1 R39.1 R40.1 R41.1 R42.1
Lasers+12VDC: D11.2 D12.2 D13.2 K4.2(COIL1) K5.2(COIL1) K6.2(COIL1) K9.4(NO)
Motors+12VDC: D8.2 D9.2 D10.2 K1.2(COIL1) K2.2(COIL1) K3.2(COIL1) K8.4(NO)
CAN_N: ESD9.1 J3.2
CAN_P: ESD9.2 J3.1
DATA: P5.1
DATA_5V: P6.1
K1: R18.2 R37.2
K2: R19.2 R38.2
K3: R20.2 R39.2
K4: R21.2 R40.2
K5: R22.2 R41.2
K6: R23.2 R42.2
K7: K7.3(COM) P2.1 P17.2
K8: D5.2 K8.2(COIL1) P1.1
K9: D7.2 K9.2(COIL1) P4.1
L1: P15.2
L2: P15.3
L3: P15.4
L4: P15.5
L5: P15.6
L6: P15.7
MB_N: ESD8.1 P13.2
MB_P: ESD8.2 P13.1
NO1: C4.1 D19.2 ESD10.2 K1.4(NO) P18.2
NO2: C19.1 D18.2 ESD5.2 K2.4(NO) P6.2
NO3: C18.1 D17.2 ESD4.2 K3.4(NO) P5.2
NO4: C15.1 D14.2 ESD6.2 K4.4(NO) P8.2
NO5: C16.1 D15.2 ESD2.2 K5.4(NO) P9.2
NO6: C17.1 D16.2 ESD3.2 K6.4(NO) P10.2
NO7: D6.2 K7.2(COIL1) K7.4(NO) P1.2 P4.2 P17.1  [also labelled Safety]
P1: P16.1
P2: P16.3
P3: P16.5
P4: P16.7
P5: P16.9
P6: P16.11
P7: P16.13
P8: P16.15
Power +: Power_Input1.1 Power_Input2.1
RX_Direct: ESD7.1 P11.2
Step1: P7.4
Step2: P7.3
Step3: P7.2
Step4: P7.1
TX_Direct_5V: ESD7.2 P11.1
NetD8_1: D8.1 K1.1(COIL2) Q1.2(C)
NetD9_1: D9.1 K2.1(COIL2) Q2.2(C)
NetD10_1: D10.1 K3.1(COIL2) Q3.2(C)
NetD11_1: D11.1 K4.1(COIL2) Q4.2(C)
NetD12_1: D12.1 K5.1(COIL2) Q5.2(C)
NetD13_1: D13.1 K6.1(COIL2) Q6.2(C)
NetD20_2: D20.2 J3.8
NetQ1_1: Q1.1(B) R18.1
NetQ2_1: Q2.1(B) R19.1
NetQ3_1: Q3.1(B) R20.1
NetQ4_1: Q4.1(B) R21.1
NetQ5_1: Q5.1(B) R22.1
NetQ6_1: Q6.1(B) R23.1

Not connected (* = marked no-connect by the designer): J3 4 5; K1 5(NC)*; K2 5(NC)*; K3 5(NC)*; K4 5(NC)*; K5 5(NC)*; K6 5(NC)*; K7 5(NC)*; K8 5(NC)*; K9 5(NC)*

### Notes on the sheet
- Latch Breaker
- Latch PushButton
- NO
- (near K8) Motors Safety
- NC
- System      Safety
- (near K9) Lasers Safety
- (near P7) Stepper 1
- Buzzer
- Servo 1
- Servo 2
- Laser 1
- Laser 2
- Laser 3
- Motors Control
- Lasers Control
- (near Power_Input2) ATech Laser Turret Controller
- Terminals
- Actuaters Control Schematic
- Safety and Relays Schematic
- V1.0
- Saaid JABR

### Library data of the parts
C4 C15-C19 = CAPACITOR NON-POL: Capacitor; Ozdisan: CL31B104KCFNNNE; Stock Code: *; Component Type: Capacitor; PriceUSD: 0.001135
D5-D20 = DIODE SCHOTTKY: as D1 on sheet Servo Bus Controller; Stock Code: *; Component Type: Diode; PriceUSD: 0.006698
ESD2-ESD6 ESD10 = SMAJ40CA: Ozdisan: SMAJ40CA-HT; Price: None; Availability: Unavailable; Package: None; MP: SMAJ40CA; Value: *; PriceUSD: 0.012908
J3 = CONNECTOR Ether x8: Jack Modular Connector 8p8c (RJ45, Ethernet) 90Â° Angle (Right) Shielded, EMI Finger Cat3; MP: 0438600004; MF: Molex; SnapEDA_Link: https://www.snapeda.com/parts/0438600004/Molex/view-part/?ref=snap; Package: None; Check_prices: https://www.snapeda.com/parts/0438600004/Molex/view-part/?ref=eda; Purchase-URL: https://pricing.snapeda.com/search/part/0438600004/?ref=eda; Digi-Key_Part_Number: WM5438-ND; Value: *
K1-K9 = Relay-HF152FD/012
P1 P2 P4 P8-P10 P13 P17 P18 Power_Input1 Power_Input2 = CONNECTOR, 1x2, 2P: Ozdisan: DG128-5.0-02P-14-00AH; Stock Code: *; Component Type: Connector; PriceUSD: 0.10443
P15 = CONNECTOR, 1X8, 8P: Stock Code: *; Component Type: Connector
P16 = CONNECTOR, 2x8, 16P: Stock Code: *; Component Type: Connector
P19 = CONNECTOR, 2x3, 3P: Component Type: Connector
Q1-Q6 = BCX56: BCX56-16,115 Bipolar (BJT) Transistor NPN 80 V 1 A 180MHz 1.25 W Surface Mount SOT-89; MF: Nexperia USA; SnapEDA_Link: https://www.snapeda.com/parts/BCX56-16,115/Nexperia/view-part/?ref=snap; Package: SOT89-3 Nexperia USA Inc.; Value: *; MP: BCX56-16,115; Check_prices: https://www.snapeda.com/parts/BCX56-16,115/Nexperia/view-part/?ref=eda
R18-R23 R37-R42 = RESISTOR: Ozdisan: RC1206JR-074K7L; Component Type: Resistor; PriceUSD: 0.0000351
ESD7-ESD9 = SDT23C24L02: Stock Code: *; Component Type: Diode; Ozdisan: SDT23C24L02; PriceUSD: 0.09211
P5 P6 P11 = CONNECTOR, 1x3, 3P: Component Type: Connector
P7 = CONNECTOR, 1x4, 4P: Component Type: Connector

## Nets that join several sheets
+3V3: Servo Bus Controller (21 pins), STM32 Control (20 pins), Actuator Control (P15.1)
+5VDC: Servo Bus Controller (14 pins), STM32 Control (C30.1 U3.19), Actuator Control (D20.1 K6.3 P19.3 P19.6)
+12VDC: Servo Bus Controller (5 pins), Actuator Control (10 pins)
GND: Servo Bus Controller (49 pins), STM32 Control (33 pins), Actuator Control (62 pins)
CAN_N: Servo Bus Controller (CAN1.6 R34.1), Actuator Control (ESD9.1 J3.2)
CAN_P: Servo Bus Controller (CAN1.7 R34.2), Actuator Control (ESD9.2 J3.1)
DATA: Servo Bus Controller (J1.4 J2.2 R14.1 U4.3), Actuator Control (P5.1)
DATA_5V: Servo Bus Controller (U4.4), Actuator Control (P6.1)
K1: STM32 Control (U2.11), Actuator Control (R18.2 R37.2)
K2: STM32 Control (U2.12), Actuator Control (R19.2 R38.2)
K3: STM32 Control (U2.13), Actuator Control (R20.2 R39.2)
K4: STM32 Control (U2.14), Actuator Control (R21.2 R40.2)
K5: STM32 Control (U2.15), Actuator Control (R22.2 R41.2)
K6: STM32 Control (U2.16), Actuator Control (R23.2 R42.2)
L1: STM32 Control (U2.38), Actuator Control (P15.2)
L2: STM32 Control (U2.39), Actuator Control (P15.3)
L3: STM32 Control (U2.40), Actuator Control (P15.4)
L4: STM32 Control (U2.41), Actuator Control (P15.5)
L5: STM32 Control (U2.42), Actuator Control (P15.6)
L6: STM32 Control (U2.43), Actuator Control (P15.7)
MB_N: Servo Bus Controller (C8.1 MODBUS1.7 R8.2 R11.1), Actuator Control (ESD8.1 P13.2)
MB_P: Servo Bus Controller (C7.1 MODBUS1.6 R6.2 R8.1), Actuator Control (ESD8.2 P13.1)
P1: STM32 Control (R52.2), Actuator Control (P16.1)
P2: STM32 Control (R57.2), Actuator Control (P16.3)
P3: STM32 Control (R59.2), Actuator Control (P16.5)
P4: STM32 Control (R61.2), Actuator Control (P16.7)
P5: STM32 Control (R63.2), Actuator Control (P16.9)
P6: STM32 Control (R65.2), Actuator Control (P16.11)
P7: STM32 Control (R67.2), Actuator Control (P16.13)
P8: STM32 Control (R69.2), Actuator Control (P16.15)
Power +: Servo Bus Controller (ESD1.2 Fuse1.1), Actuator Control (Power_Input1.1 Power_Input2.1)
RX_Direct: Servo Bus Controller (P3.6), Actuator Control (ESD7.1 P11.2)
SCL: Servo Bus Controller (U1.36 U1.60), STM32 Control (R48.1 R68.1 U2.26)
SDA: Servo Bus Controller (U1.33 U1.63), STM32 Control (R49.1 R66.1 U2.27)
Step1: Servo Bus Controller (U1.9 U1.47), Actuator Control (P7.4)
Step2: Servo Bus Controller (U1.10 U1.48), Actuator Control (P7.3)
Step3: Servo Bus Controller (U1.11 U1.49), Actuator Control (P7.2)
Step4: Servo Bus Controller (U1.12 U1.50), Actuator Control (P7.1)
STM32_RX3: Servo Bus Controller (U1.8 U1.46), STM32 Control (U2.21)
STM32_TX3: Servo Bus Controller (U1.7 U1.45), STM32 Control (U2.22)
TX_Direct_5V: Servo Bus Controller (U5.3), Actuator Control (ESD7.2 P11.1)